# Altium schematic sheet blum_SumoBRD_ECEN2440F24.SchDoc
size A; SheetNumber: 1; SheetTotal: 1
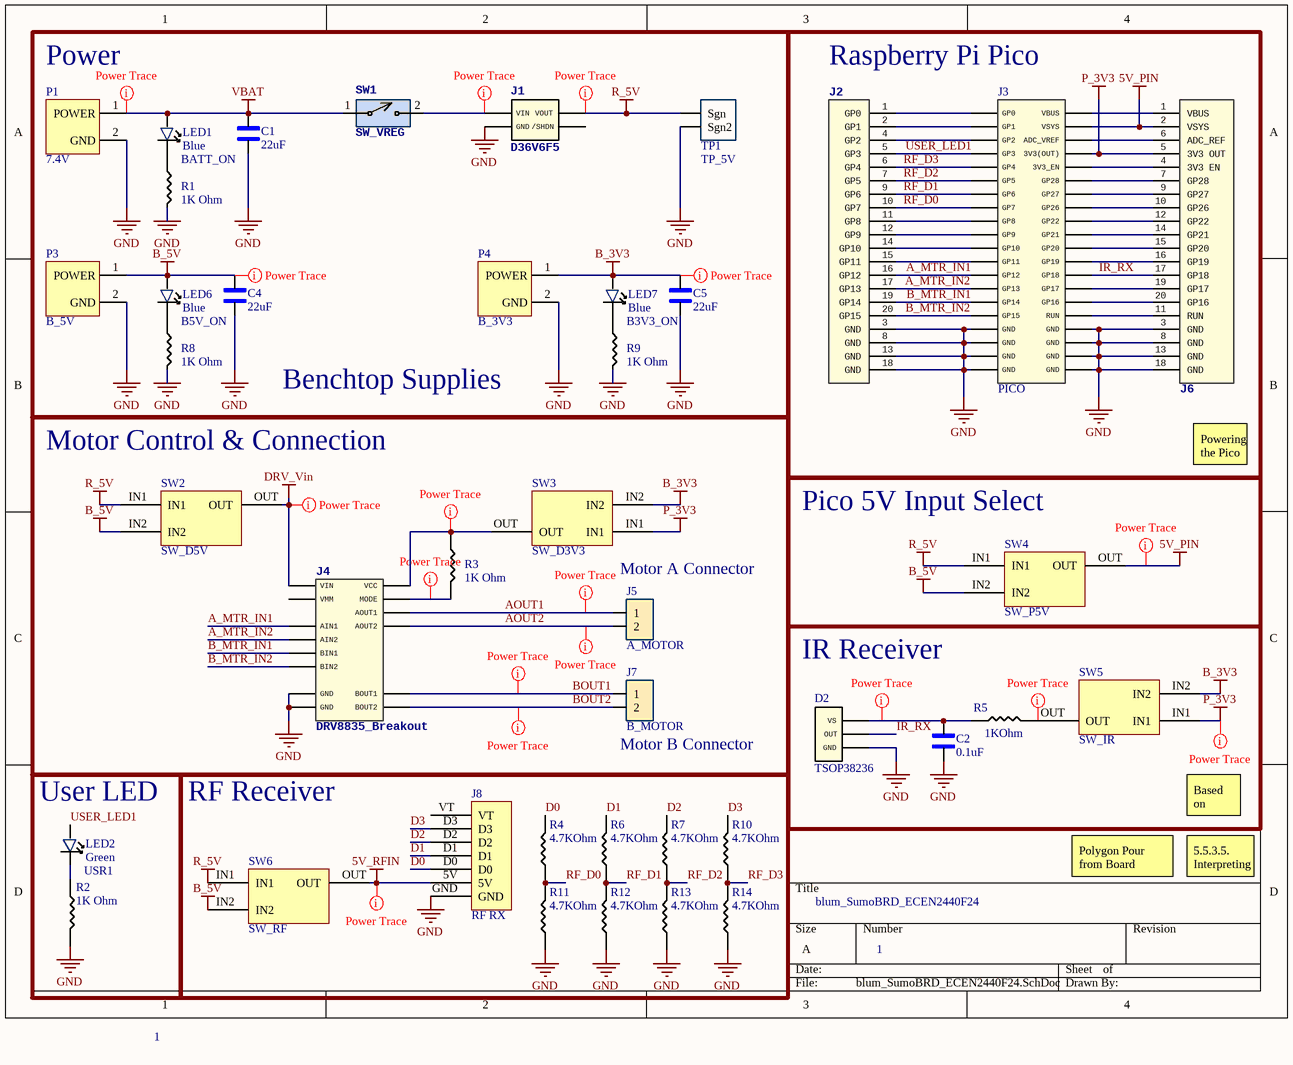
[diagram p0: blum_SumoBRD_ECEN2440F24.SchDoc]

## Parts
C1  22uF  [1206_Passive_Capacitor]
C2  0.1uF  [1206_Passive_Capacitor]
C4  22uF  [1206_Passive_Capacitor]
C5  22uF  [1206_Passive_Capacitor]
D2  TSOP38236  [D_TSOP38238]
J1  D36V6F5  [D36V6F5_JF_4]
J2  SAMTEC-SSQ-107-01-X-SJ  [JF-20-SSQ-1020-X]  (value not drawn)
J3  PICO  [RASPBERRY_PI_PICO]
J4  DRV8835_Breakout  [JF_14_DRV8835]
J5  A_MOTOR  [2_PIN_100MIL]
J6  SAMTEC-SSQ-107-01-X-SJ  [JF-20-SSQ-1020-X]  (value not drawn)
J7  B_MOTOR  [2_PIN_100MIL]
J8  RF RX  [JF_RF_Receiver]
LED1  BATT_ON  value Blue  [LED_1206]
LED2  USR1  value Green  [LED_1206]
LED6  B5V_ON  value Blue  [LED_1206]
LED7  B3V3_ON  value Blue  [LED_1206]
P1  7.4V  [P_JST_RCY]
P3  B_5V  [P_Terminal block 3.5mm-pitch]
P4  B_3V3  [P_Terminal block 3.5mm-pitch]
R1  value 1K Ohm  [1206_Passive_Resitor]  (hidden comment: 1k)
R2  value 1K Ohm  [1206_Passive_Resitor]  (hidden comment: 1k)
R3  value 1K Ohm  [1206_Passive_Resitor]  (hidden comment: 1k)
R4  4.7KOhm  [1206_Passive_Resitor]
R5  value 1KOhm  [1206_Passive_Resitor]  (hidden comment: 1k)
R6  4.7KOhm  [1206_Passive_Resitor]
R7  4.7KOhm  [1206_Passive_Resitor]
R8  value 1K Ohm  [1206_Passive_Resitor]  (hidden comment: 1k)
R9  value 1K Ohm  [1206_Passive_Resitor]  (hidden comment: 1k)
R10  4.7KOhm  [1206_Passive_Resitor]
R11  4.7KOhm  [1206_Passive_Resitor]
R12  4.7KOhm  [1206_Passive_Resitor]
R13  4.7KOhm  [1206_Passive_Resitor]
R14  4.7KOhm  [1206_Passive_Resitor]
SW1  SW_VREG  [2Pin-Header-Conn]
SW2  SW_D5V  [3PIN_SWITCH]
SW3  SW_D3V3  [3PIN_SWITCH]
SW4  SW_P5V  [3PIN_SWITCH]
SW5  SW_IR  [3PIN_SWITCH]
SW6  SW_RF  [3PIN_SWITCH]
TP1  TP_5V  [TP_Diff_Probe]

## Blocks framed on the sheet
Raspberry Pi Pico: J2 J3 J6
Motor Control & Connection: J4 J5 J7 R3 SW2 SW3
IR Receiver: C2 D2 R5 SW5
Pico 5V Input Select: SW4
User LED: LED2 R2
RF Receiver: J8 R4 R6 R7 R10-R14 SW6

## Nets
5V_PIN: J3.39(VSYS) J6.2(VSYS) SW4.OUT
5V_RFIN: J8.5V SW6.OUT
B_3V3: C5.1 LED7.1 P4.1(POWER) SW3.IN2 SW5.IN2
B_5V: C4.1 LED6.1 P3.1(POWER) SW2.IN2 SW4.IN2 SW6.IN2
DRV_Vin: J4.2(VIN) SW2.OUT
GND: C1.2 C2.1 C4.2 C5.2 D2.D_GND(GND) J1.REG_GND(GND) J2.3(GND) J2.8(GND) J2.13(GND) J2.18(GND) J3.3(GND) J3.8(GND) J3.13(GND) J3.18(GND) J3.23(GND) J3.28(GND) J3.33(GND) J3.38(GND) J4.1(GND) J4.14(GND) J6.3(GND) J6.8(GND) J6.13(GND) J6.18(GND) J8.GND P1.2(GND) P3.2(GND) P4.2(GND) R1.2 R2.2 R8.2 R9.2 R11.1 R12.1 R13.1 R14.1 TP1.2(Sgn2)
P_3V3: J3.36(3V3(OUT)) J6.5(3V3_OUT) SW3.IN1 SW5.IN1
R_5V: J1.REG_VOUT(VOUT) SW2.IN1 SW4.IN1 SW6.IN1 TP1.1(Sgn)
VBAT: C1.1 LED1.1 P1.1(POWER) SW1.1
A_MTR_IN1: J2.16(GP12) J3.16(GP12) J4.9(AIN1)
A_MTR_IN2: J2.17(GP13) J3.17(GP13) J4.10(AIN2)
AOUT1: J4.6(AOUT1) J5.1
AOUT2: J4.5(AOUT2) J5.2
B_MTR_IN1: J2.19(GP14) J3.19(GP14) J4.11(BIN1)
B_MTR_IN2: J2.20(GP15) J3.20(GP15) J4.12(BIN2)
BOUT1: J4.4(BOUT1) J7.1
BOUT2: J4.3(BOUT2) J7.2
D0: J8.D0 R4.2
D1: J8.D1 R6.2
D2: J8.D2 R7.2
D3: J8.D3 R10.2
IR_RX: D2.D_OUT(OUT) J3.24(GP18) J6.17(GP18)
RF_D0: J2.10(GP7) J3.10(GP7) R4.1 R11.2
RF_D1: J2.9(GP6) J3.9(GP6) R6.1 R12.2
RF_D2: J2.7(GP5) J3.7(GP5) R7.1 R13.2
RF_D3: J2.6(GP4) J3.6(GP4) R10.1 R14.2
USER_LED1: J2.5(GP3) J3.5(GP3) LED2.1
NetC2_2: C2.2 D2.D_VS(VS) R5.1
NetJ1_REG_VIN: J1.REG_VIN(VIN) SW1.2
NetJ2_1: J2.1(GP0) J3.1(GP0)
NetJ2_2: J2.2(GP1) J3.2(GP1)
NetJ2_4: J2.4(GP2) J3.4(GP2)
NetJ2_11: J2.11(GP8) J3.11(GP8)
NetJ2_12: J2.12(GP9) J3.12(GP9)
NetJ2_14: J2.14(GP10) J3.14(GP10)
NetJ2_15: J2.15(GP11) J3.15(GP11)
NetJ3_21: J3.21(GP16) J6.20(GP16)
NetJ3_22: J3.22(GP17) J6.19(GP17)
NetJ3_25: J3.25(GP19) J6.16(GP19)
NetJ3_26: J3.26(GP20) J6.15(GP20)
NetJ3_27: J3.27(GP21) J6.14(GP21)
NetJ3_29: J3.29(GP22) J6.12(GP22)
NetJ3_30: J3.30(RUN) J6.11(RUN)
NetJ3_31: J3.31(GP26) J6.10(GP26)
NetJ3_32: J3.32(GP27) J6.9(GP27)
NetJ3_34: J3.34(GP28) J6.7(GP28)
NetJ3_35: J3.35(ADC_VREF) J6.6(ADC_REF)
NetJ3_37: J3.37(3V3_EN) J6.4(3V3_EN)
NetJ3_40: J3.40(VBUS) J6.1(VBUS)
NetJ4_8: J4.8(MODE) R3.2
NetJ4_13: J4.13(VCC) R3.1 SW3.OUT
NetLED1_2: LED1.2 R1.1
NetLED2_2: LED2.2 R2.1
NetLED6_2: LED6.2 R8.1
NetLED7_2: LED7.2 R9.1
NetR5_2: R5.2 SW5.OUT

Not connected (* = marked no-connect by the designer): J1 REG_SHDN(/SHDN); J4 7(VMM); J8 VT (VT)

## Layout directives
rule Width Constraint [Pref Width = 20mil    Min Width = 10mil    Max Width = 100mil]: 5V_PIN, 5V_RFIN, AOUT1, AOUT2, B_3V3, B_5V, BOUT1, BOUT2, DRV_Vin, NetC2_2, NetJ1_REG_VIN, NetJ4_8, NetJ4_13, NetR5_2, P_3V3, R_5V, VBAT

## Notes on the sheet
- (near P1) Power
- Benchtop Supplies
- Powering the Pico through VSYS
- Motor A Connector
- (near J7) Motor B Connector
- Based on testing, need C = 0.1 µF and R = 1 kΩ.
  According to the datasheet the RC circuit is for protection against EOS.
  33 Ω < R < 1 kΩ
  C > 0.1 µF
  (TSOP382 datasheet pg 1) most schematics omits this RC circuit but we need to be sure that the supply current for the TSOP is within the recommended ratings: ~0.35mA, so we need a current limiting resistor here.
  3.3V/10kohm = 0.33mA
- blum_SumoBRD_ECEN2440F24
- Polygon Pour from Board Shape, at 3:19min:
  https://www.youtube.com/watch?v=RM18_zJs31E
- 5.5.3.5. Interpreting GPIO output voltage specifications, pg 620:
  The GPIOs on RP2040 have four different output drive strengths, which are nominally called 2, 4, 8 and 12mA modes.
  https://datasheets.raspberrypi.com/rp2040/rp2040-datasheet.pdf
- 1

## Library data of the parts
C1 C4 C5 = C_22uF_1206: 22uF ±10% 25V X5R 1206 Multilayer Ceramic Capacitors MLCC - SMD/SMT RoHS; MFR Part #: CL31A226KAHNNNE; Type: basic; LCSC Part#: C12891; Datasheet: https://datasheet.lcsc.com/lcsc/1811031514_Samsung-Electro-Mechanics-CL31A226KAHNNNE_C12891.pdf; Value: 22uF
C2 = C_0.1uF_1206: MULTILAYER CERAMIC CAPACITORS MLCC - SMD/SMT 0.1UF 50V 1206 ROHS; MFR Part #: CL31B104MBCNNNC; Type: Basic; Digikey Link: https://www.digikey.com/product-detail/en/C1206C105M4RACTU/399-8150-1-ND/3471873/?itemSeq=304982366; LCSC Part#: C730479; Value: 0.1uF
D2 = D_TSOP38238: IR Receiver, TSOP38236, 36 kHz
J1 = D36V6F5_JF_4: 5V, 600mA Step Down Voltage Regulator, D36V6F5. 2.54mm, P=2.54mm, Female Headers ROHS; ComponentLink1Description: Breakout Board Link; ComponentLink1URL: https://www.pololu.com/product/3792
J2 = JF_20_PIN_FEMALE_L: 2.54mm Brass Straight 1x7P 7 1 Straight,P=2.54mm  Female Headers ROHS; MFR PART #: B-2200S07P-A120; MP: SAMTEC-SSQ-107-01-X-SJ; LCSC PART#: C124418
J3 = JF_RASPBERRY_PI_PICO
J4 = DRV8835_JF_14: Pololu DRV8835 Breakout Board / 2.54mm, P=2.54mm, Female Headers ROHS; ComponentLink1Description: Breakout Board Link; ComponentLink1URL: https://www.pololu.com/product/2135
J5 = JM_2_PIN_MALE: 2.54mm Straight 2 1 Header，Breakaway Through Hole,P=2.54mm Pin Header & Female Header ROHS; MFR Part #: B-2100S02P-A110; Type: Extended; Datasheet: https://datasheet.lcsc.com/lcsc/1811151421_Ckmtw-Shenzhen-Cankemeng-B-2100S02P-A110_C124375.pdf; LCSC Part#: C124375
J6 = JF_20_PIN_FEMALE_R: 2.54mm Brass Straight 1x7P 7 1 Straight,P=2.54mm  Female Headers ROHS; MFR PART #: B-2200S07P-A120; MP: SAMTEC-SSQ-107-01-X-SJ; LCSC PART#: C124418
J7 = JM_2_PIN_MALE_1: 2.54mm Straight 2 1 Header，Breakaway Through Hole,P=2.54mm Pin Header & Female Header ROHS; MFR Part #: B-2100S02P-A110; Type: Extended; Datasheet: https://datasheet.lcsc.com/lcsc/1811151421_Ckmtw-Shenzhen-Cankemeng-B-2100S02P-A110_C124375.pdf; LCSC Part#: C124375
J8 = JF_RF_Receiver: RF Receiver, 7 pin
LED1 = LED_BLUE_1206: blue 1206  Light Emitting Diodes (LED) ROHS; MFR Part #: NCD1206B1; Type: Extended; LCSC Part#: C130717; Datasheet: https://datasheet.lcsc.com/lcsc/2008201033_Foshan-NationStar-Optoelectronics-NCD1206B1_C130717.pdf
LED2 = LED_GREEN_1206: Green 513~528nm 1206 Light Emitting Diodes (LED) RoHS; MFR Part #: SZYY1206G; Type: Extended; LCSC Part#: C434439; Datasheet: https://datasheet.lcsc.com/lcsc/2006301532_Yongyu-Photoelectric-SZYY1206G_C434439.pdf
LED6 LED7 = LED_BLUE_1206: Benchtop Power Supply 5V output ON / blue 1206  Light Emitting Diodes (LED) ROHS; MFR Part #: NCD1206B1; Type: Extended; LCSC Part#: C130717; Datasheet: https://datasheet.lcsc.com/lcsc/2008201033_Foshan-NationStar-Optoelectronics-NCD1206B1_C130717.pdf
P1 = P_JST_RCY: JST RCY for LiPO battery
P3 = P_Terminal block: Benchtop Power Supply: 5V / Green Straight pin 3.5mm  pitch; P=3.5mm  Screw terminal ROHS; MFR Part #: KF350-3.5-2P; Manufacturer: Cixi Kefa Elec; LCSC Part#: C474892; DataSheet: https://datasheet.lcsc.com/lcsc/2001160007_Cixi-Kefa-Elec-KF350-3-5-2P_C474892.pdf
P4 = P_Terminal block: Benchtop Power Supply: 3V3 / Green Straight pin 3.5mm  pitch; P=3.5mm  Screw terminal ROHS; MFR Part #: KF350-3.5-2P; Manufacturer: Cixi Kefa Elec; LCSC Part#: C474892; DataSheet: https://datasheet.lcsc.com/lcsc/2001160007_Cixi-Kefa-Elec-KF350-3-5-2P_C474892.pdf
R1-R3 R8 R9 = R_1K_1206: CHIP RESISTOR - SURFACE MOUNT 1KOHMS ±1% 1/4W 1206 ROHS; MFR Part #: RNCP1206FTD1K00CT; Digikey Link: https://www.digikey.com/product-detail/en/RNCP1206FTD1K00/RNCP1206FTD1K00CT-ND/2240675/?itemSeq=304982373; LCSC Part#: C4410; Type: Basic
R4 R6 R7 R10-R14 = R_4.7k_1206: 4.7kΩ ±1% 0.25W ±100ppm/℃ 1206 Chip Resistor - Surface Mount RoHS; MFR Part #: 1206W4F4701T5E; LCSC Part#: C17936; Datasheet: https://datasheet.lcsc.com/lcsc/1810301414_UNI-ROYAL-Uniroyal-Elec-1206W4F4701T5E_C17936.pdf; Type: Basic; Value: 4.7KOhm
R5 = R_10KOhm_1206: 10 kOhms ±5% 0.25W, 1/4W Chip Resistor 1206 (3216 Metric) Automotive AEC-Q200 Thick Film; MFR Part #: RMCF1206FT10K0; Digikey Link: https://www.digikey.com/en/products/detail/stackpole-electronics-inc/RMCF1206FT10K0/1759669; LCSC Part#: C17902; Type: Basic
SW1 = SW_2Pin_100mil_Switch: 2Pin Header; LCSC Part#: C124375; Type: Extended
SW2-SW6 = SW_3Pin: 3Pin Header
TP1 = TP_Diff_Probe: Test Point 300 mil centers